# EAGLE design Arduino_fuer_LEDs_DCC_5 (EAGLE 9.5.2)

## Sheet 1 of 2
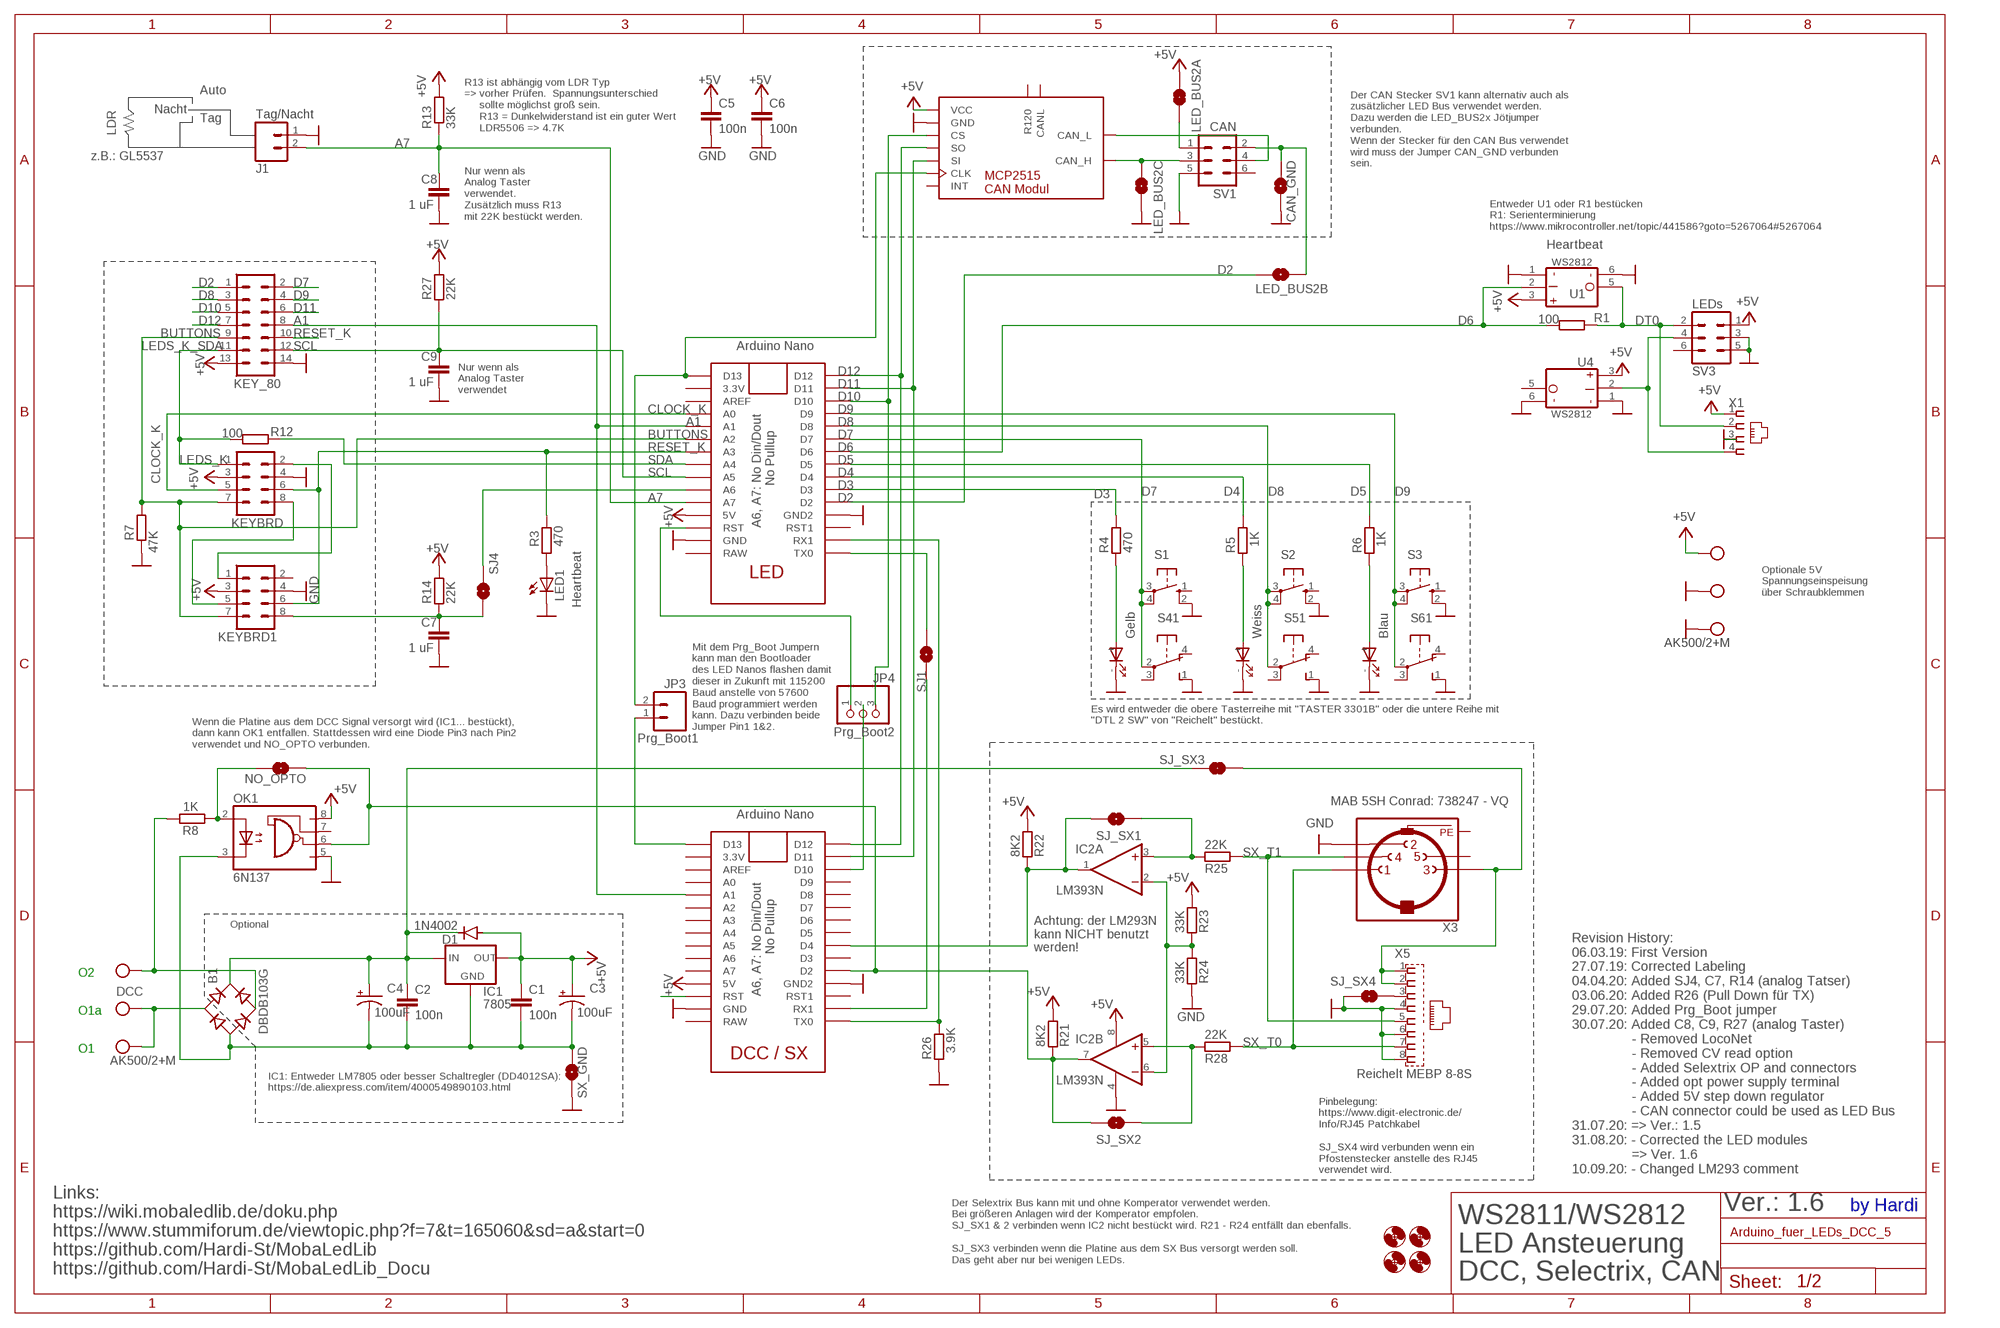
[diagram p0: schematic, sheet 1]

### Parts
B1  DBDB103G  DBDB10G  [DB]
C1  100n  C-EU025-025X050  [C025-025X050]
C2  100n  C-EU025-025X050  [C025-025X050]
C3  100uF  SPARKFUN-CAPACITORS_100UF-25V-20%(PTH)  [SPARKFUN-CAPACITORS_CPOL-RADIAL-100UF-25V]
C4  100uF  SPARKFUN-CAPACITORS_100UF-25V-20%(PTH)  [SPARKFUN-CAPACITORS_CPOL-RADIAL-100UF-25V]
C5  100n  C-EU025-025X050  [C025-025X050]
C6  100n  C-EU025-025X050  [C025-025X050]
C7  1 uF  C-EU025-025X050  [C025-025X050]
C8  1 uF  C-EU025-025X050  [C025-025X050]
C9  1 uF  C-EU025-025X050  [C025-025X050]
CAN2  MCP2515_CAN_MODUL  [MCP2515_CAN_MODUL]
CAN_GND  SOLDERJUMPERNO  [SJ_2S-NO]
D1  1N4002  1N4004  [DO41-10]
H1  MOUNT-HOLE3.0  [3,0]
H2  MOUNT-HOLE3.0  [3,0]
H3  MOUNT-HOLE3.0  [3,0]
H4  MOUNT-HOLE3.0  [3,0]
IC1  7805  78XXS  [78XXS]
IC2  LM393N  [DIL08]
J1  Tag/Nacht  M02PTH  [1X02]
JP3  Prg_Boot1  M02PTH  [1X02]
JP4  Prg_Boot2  PINHD-1X3CB  [1X03-CLEANBIG]
KEY_80  ML14  [ML14]
KEYBRD  CON-HARTING-ML_ML08  [CON-HARTING-ML_ML08]
KEYBRD1  CON-HARTING-ML_ML08  [CON-HARTING-ML_ML08]
LED1  Heartbeat  LED3MM  [LED3MM]
LED_BUS2A  SOLDERJUMPERNO  [SJ_2S-NO]
LED_BUS2B  SOLDERJUMPERNO  [SJ_2S-NO]
LED_BUS2C  SOLDERJUMPERNO  [SJ_2S-NO]
NO_OPTO  SOLDERJUMPERNO  [SJ_2S-NO]
OK1  6N137  [DIL08]
R1  100  R0204/7  [0204/7]
R3  470  R0204/7  [0204/7]
R4  470  R0204/7  [0204/7]
R5  1K  R0204/7  [0204/7]
R6  1K  R0204/7  [0204/7]
R7  47K  R0204/7  [0204/7]
R8  1K  R0204/7  [0204/7]
R12  100  R0204/7  [0204/7]
R13  33K  R0204/7  [0204/7]
R14  22K  R0204/7  [0204/7]
R21  8K2  R-EU_0207/2V  [0207/2V]
R22  8K2  R-EU_0207/2V  [0207/2V]
R23  33K  R-EU_0207/2V  [0207/2V]
R24  33K  R-EU_0207/2V  [0207/2V]
R25  22K  R-EU_0207/2V  [0207/2V]
R26  3.9K  R0204/7  [0204/7]
R27  22K  R0204/7  [0204/7]
R28  22K  R-EU_0207/2V  [0207/2V]
S1  10-XX  [B3F-10XX]
S2  10-XX  [B3F-10XX]
S3  10-XX  [B3F-10XX]
S4  Gelb  SRKL  [SRKL]
S5  Weiss  SRKL  [SRKL]
S6  Blau  SRKL  [SRKL]
SJ1  SOLDERJUMPERNO  [SJ_2S-NO]
SJ4  SOLDERJUMPERNO  [SJ_2S-NO]
SJ_SX1  SOLDERJUMPERNO  [SJ_2S-NO]
SJ_SX2  SOLDERJUMPERNO  [SJ_2S-NO]
SJ_SX3  SOLDERJUMPERNO  [SJ_2S-NO]
SJ_SX4  SOLDERJUMPERNO  [SJ_2S-NO]
SV1  CAN  ML6  [ML6]
SV3  LEDs  ML6  [ML6]
SX_GND  SOLDERJUMPERNO  [SJ_2S-NO]
U1  WS2812_MODUL  [WS2812_LED_MODUL]
U2  LED NANO  NANO  [NANO]
U3  DCC NANO  NANO  [NANO]
U4  WS2812_MODUL  [WS2812_LED_MODUL]
X1  RJ10  [RJ10]
X2  AK500/2+M  [AK500/2+M]
X3  MAB 5SH Conrad: 738247 - VQ  MAB5SH  [MAB5SH]
X4  AK500/2+M  [AK500/2+M]
X5  Reichelt MEBP 8-8S  RJ45_MEBP8-8S  [RJ45_MEBP8-8S]

### Nets
+5V: C1.1 C3.1(+) C5.1 C6.1 CAN2.1(VCC) D1.A IC1.OUT IC2.8(P:V+) KEY_80.13 KEYBRD1.3 KEYBRD.3 LED_BUS2A.1 OK1.8(VCC) R13.2 R14.2 R21.2 R22.2 R23.2 R27.2 SV3.1 U1.3(VDD) U2.5V U3.5V U4.3(VDD) X1.1 X4.2 ; also sheet 2
A1: KEY_80.8 U2.A1 U3.A1
A7: C8.1 J1.2 R13.1 U2.A7
BUTTONS: KEY_80.9 KEYBRD1.7 KEYBRD.7 R7.2 U2.A2
CAN_H: CAN2.9(CAN_H) LED_BUS2C.1 SV1.3
CAN_L: CAN2.8(CAN_L) SV1.4
CLOCK_K: KEYBRD.5 U2.A0
D2: KEY_80.1 LED_BUS2B.1 U2.D2
D3: R4.2 U2.D3
D4: R5.2 U2.D4
D5: R6.2 U2.D5
D6: R1.2 U1.2(DIN) U2.D6
D7: KEY_80.2 S1.3(P) S1.4(P1) S4.2(1:P) U2.D7
D8: KEY_80.3 S2.3(P) S2.4(P1) S5.2(1:P) U2.D8
D9: KEY_80.4 S3.3(P) S3.4(P1) S6.2(1:P) U2.D9
D10: CAN2.3(CS) JP4.3 KEY_80.5 U2.D10
D11: CAN2.5(SI) KEY_80.6 U2.D11 U3.D11
D12: CAN2.4(SO) KEY_80.7 U2.D12 U3.D12
DT0: R1.1 SV3.2 U1.5(DO) X1.2 ; also sheet 2
GND: C5.2 C6.2 C7.2 C8.2 C9.2 CAN2.2(GND) CAN_GND.2 IC2.4(P:V-) J1.1 KEY_80.14 KEYBRD1.4 KEYBRD.4 LED1.K(C) LED_BUS2C.2 OK1.5(GND) R7.1 R24.1 R26.1 S1.2(S1) S2.2(S1) S3.2(S1) S4.1(1:S) S4.-(D1:C) S5.1(1:S) S5.-(D1:C) S6.1(1:S) S6.-(D1:C) SJ_SX4.2 SV1.5 SV3.3 SV3.5 SX_GND.2 U1.1(GND) U1.6(GND1) U2.GND U2.GND1(GND2) U3.GND U3.GND1(GND2) U4.1(GND) U4.6(GND1) X1.3 X3.2 X4.1 X4.M X5.4 X5.6 X5.8 ; also sheet 2
LEDS_K_SDA: KEY_80.11 KEYBRD.1 R12.2
N$1: SJ1.2 U2.TX0
N$2: SJ_SX4.1 X5.3
N$3: R26.2 U2.RX1 U3.TX0
N$4: R4.1 S4.+(D1:A)
N$5: CAN2.6(CLK) JP3.2 U2.D13
N$6: R5.1 S5.+(D1:A)
N$7: R6.1 S6.+(D1:A)
N$8: IC2.7(B:OUT) NO_OPTO.1 OK1.6(VO) R21.1 SJ_SX2.2 U3.D2
N$9: U3.RST
N$10: LED_BUS2A.2 SV1.1
N$11: SV3.4 U4.2(DIN) X1.4
N$12: B1.AC2 R8.2 X2.2
N$13: B1.AC1 X2.1 X2.M
N$14: B1.+ C2.1 C4.1(+) D1.C IC1.IN SJ_SX3.2
N$15: JP4.1 U2.RST
N$16: IC2.1(A:OUT) R22.1 SJ_SX1.2 U3.D4
N$17: B1.- C1.2 C2.2 C3.2(-) C4.2(-) IC1.GND OK1.3(C) SX_GND.1
N$18: SJ1.1 U3.RX1
N$19: LED1.A R3.1
N$20: JP3.1 U3.D13
N$21: NO_OPTO.2 OK1.2(A) R8.1
N$23: C7.1 KEYBRD1.8 R14.1 SJ4.2
N$24: KEYBRD1.1 KEYBRD.2
N$25: KEYBRD1.5 KEYBRD.8
N$26: SJ_SX3.1 X3.3 X5.1 X5.2
N$27: SJ4.1 U2.A6
N$28: JP4.2 U3.D10
N$29: CAN_GND.1 LED_BUS2B.2 SV1.2
N$38: IC2.2(A:-IN) IC2.6(B:-IN) R23.1 R24.2
N$39: IC2.3(A:+IN) R25.1 SJ_SX1.1
N$42: IC2.5(B:+IN) R28.1 SJ_SX2.1
RESET_K: KEY_80.10 KEYBRD1.6 KEYBRD.6 R3.2 U2.A3
SCL: C9.1 KEY_80.12 R27.1 U2.A5
SDA: R12.1 U2.A4
SX_T0: R28.2 X3.1 X5.7
SX_T1: R25.2 X3.4 X5.5
Unconnected: CAN2.7(INT) CAN2.10(R120) CAN2.11(CANL) KEYBRD1.2 OK1.7(VE) S1.1(S) S2.1(S) S3.1(S) S4.3(1:P) S4.4(1:O) S5.3(1:P) S5.4(1:O) S6.3(1:P) S6.4(1:O) SV1.6 SV3.6 U2.3.3V U2.AREF U2.RAW U2.RST1 U3.3.3V U3.A0 U3.A2 U3.A3 U3.A4 U3.A5 U3.A6 U3.A7 U3.AREF U3.D3 U3.D5 U3.D6 U3.D7 U3.D8 U3.D9 U3.RAW U3.RST1 U4.5(DO) X3.5

### Notes on the sheet
- R13 ist abhängig vom LDR Typ
  => vorher Prüfen.  Spannungsunterschied
       sollte möglichst groß sein.
       R13 = Dunkelwiderstand ist ein guter Wert
       LDR5506 => 4.7K
- Der CAN Stecker SV1 kann alternativ auch als
  zusätzlicher LED Bus verwendet werden.
  Dazu werden die LED_BUS2x Jötjumper
  verbunden.
  Wenn der Stecker für den CAN Bus verwendet
  wird muss der Jumper CAN_GND verbunden
  sein.
- Auto
- Nacht
- Tag
- LDR
- z.B.: GL5537
- Nur wenn als
  Analog Taster
  verwendet.
  Zusätzlich muss R13 
  mit 22K bestückt werden.
- Entweder U1 oder R1 bestücken 
  R1: Serienterminierung
  https://www.mikrocontroller.net/topic/441586?goto=5267064#5267064
- Heartbeat
- Nur wenn als
  Analog Taster
  verwendet
- LEDS_K
- A6, A7: No Din/Dout 
              No Pullup
- LED
- Optionale 5V
  Spannungseinspeisung
  über Schraubklemmen
- Es wird entweder die obere Tasterreihe mit "TASTER 3301B" oder die untere Reihe mit 
  "DTL 2 SW" von "Reichelt" bestückt.
- Wenn die Platine aus dem DCC Signal versorgt wird (IC1... bestückt), 
  dann kann OK1 entfallen. Stattdessen wird eine Diode Pin3 nach Pin2
  verwendet und NO_OPTO verbunden.
- Mit dem Prg_Boot Jumpern
  kann man den Bootloader
  des LED Nanos flashen damit
  dieser in Zukunft mit 115200
  Baud anstelle von 57600
  Baud programmiert werden 
  kann. Dazu verbinden beide
  Jumper Pin1 1&2.
- Optional
- Achtung: der LM293N
  kann NICHT benutzt
  werden!
- O2
- DCC
- A6, A7: No Din/Dout 
              No Pullup
- O1a
- DCC / SX
- O1
- IC1: Entweder LM7805 oder besser Schaltregler (DD4012SA):
  https://de.aliexpress.com/item/4000549890103.html
- Pinbelegung:
  https://www.digit-electronic.de/
  Info/RJ45 Patchkabel
  
  SJ_SX4 wird verbunden wenn ein 
  Pfostenstecker anstelle des RJ45 
  verwendet wird.
- Revision History:
  06.03.19: First Version
  27.07.19: Corrected Labeling
  04.04.20: Added SJ4, C7, R14 (analog Tatser)
  03.06.20: Added R26 (Pull Down für TX)
  29.07.20: Added Prg_Boot jumper
  30.07.20: Added C8, C9, R27 (analog Taster)
                 - Removed LocoNet
                 - Removed CV read option
                 - Added Selextrix OP and connectors
                 - Added opt power supply terminal 
                 - Added 5V step down regulator
                 - CAN connector could be used as LED Bus
  31.07.20: => Ver.: 1.5
  31.08.20: - Corrected the LED modules
                 => Ver. 1.6
  10.09.20: - Changed LM293 comment
- Der Selextrix Bus kann mit und ohne Komperator verwendet werden.
  Bei größeren Anlagen wird der Komperator empfolen. 
  SJ_SX1 & 2 verbinden wenn IC2 nicht bestückt wird. R21 - R24 entfällt dan ebenfalls.
  
  SJ_SX3 verbinden wenn die Platine aus dem SX Bus versorgt werden soll.
  Das geht aber nur bei wenigen LEDs.
- Ver.: 1.6 | by Hardi
- Links:
  https://wiki.mobaledlib.de/doku.php
  https://www.stummiforum.de/viewtopic.php?f=7&t=165060&sd=a&start=0
  https://github.com/Hardi-St/MobaLedLib
  https://github.com/Hardi-St/MobaLedLib_Docu
- WS2811/WS2812
  LED Ansteuerung
  DCC, Selectrix, CAN

## Sheet 2 of 2
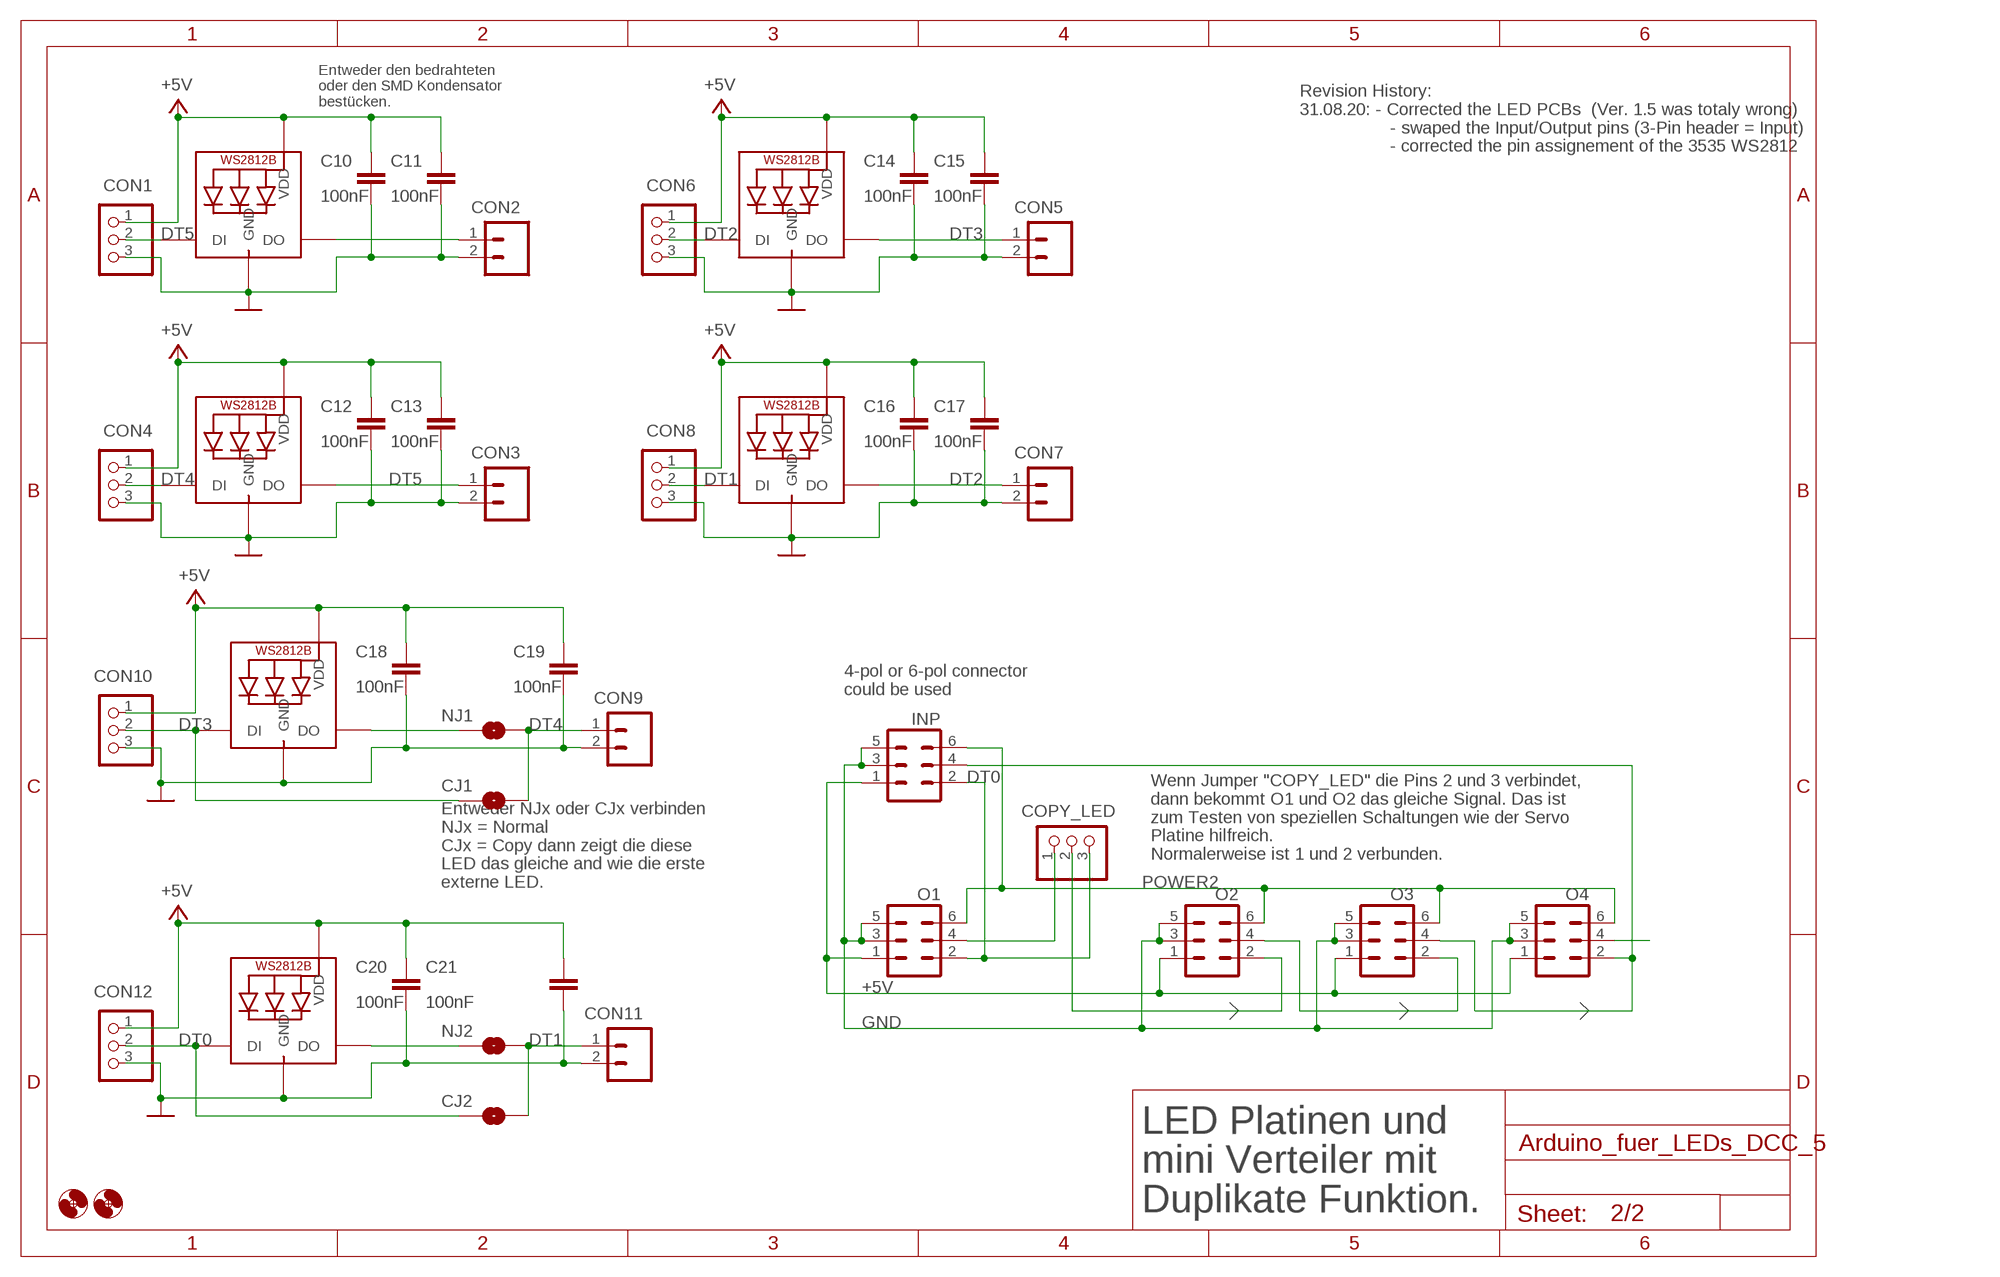
[diagram p1: schematic, sheet 2]

### Parts
C10  100nF  C-EU025-025X050  [C025-025X050]
C11  100nF  C-EUC1206  [C1206]
C12  100nF  C-EU025-025X050  [C025-025X050]
C13  100nF  C-EUC1206  [C1206]
C14  100nF  C-EU025-025X050  [C025-025X050]
C15  100nF  C-EUC1206  [C1206]
C16  100nF  C-EU025-025X050  [C025-025X050]
C17  100nF  C-EUC1206  [C1206]
C18  100nF  C-EU025-025X050  [C025-025X050]
C19  100nF  C-EUC1206  [C1206]
C20  100nF  C-EU025-025X050  [C025-025X050]
C21  100nF  C-EUC1206  [C1206]
CJ1  SOLDERJUMPERNO  [SJ_2S-NO]
CJ2  SOLDERJUMPERNO  [SJ_2S-NO]
CON1  PINHD-1X3CB  [1X03-CLEANBIG]
CON2  M02PTH  [1X02]
CON3  M02PTH  [1X02]
CON4  PINHD-1X3CB  [1X03-CLEANBIG]
CON5  M02PTH  [1X02]
CON6  PINHD-1X3CB  [1X03-CLEANBIG]
CON7  M02PTH  [1X02]
CON8  PINHD-1X3CB  [1X03-CLEANBIG]
CON9  M02PTH  [1X02]
CON10  PINHD-1X3CB  [1X03-CLEANBIG]
CON11  M02PTH  [1X02]
CON12  PINHD-1X3CB  [1X03-CLEANBIG]
COPY_LED  PINHD-1X3CB  [1X03-CLEANBIG]
H5  MOUNT-HOLE3.0  [3,0]
H6  MOUNT-HOLE3.0  [3,0]
INP  ML6  [ML6]
LED2  WS2812B5050  [WS2812B]
LED3  WS2812B5050  [WS2812B]
LED4  WS2812B3535  [LED3535]
LED5  WS2812B3535  [LED3535]
LED6  WS2812B5050  [WS2812B]
LED7  WS2812B3535  [LED3535]
NJ1  SOLDERJUMPERNO  [SJ_2S-NO]
NJ2  SOLDERJUMPERNO  [SJ_2S-NO]
O1  ML6  [ML6]
O2  ML6  [ML6]
O3  ML6  [ML6]
O4  ML6  [ML6]

### Nets
+5V: C10.1 C11.1 C12.1 C13.1 C14.1 C15.1 C16.1 C17.1 C18.1 C19.1 C20.1 C21.1 CON1.1 CON4.1 CON6.1 CON8.1 CON10.1 CON12.1 INP.1 LED2.1-5V(VDD) LED3.1-5V(VDD) LED4.1_5V(VDD) LED5.1_5V(VDD) LED6.1-5V(VDD) LED7.1_5V(VDD) O1.1 O2.1 O3.1 O4.1 ; also sheet 1
DT0: CJ2.1 CON12.2 COPY_LED.3 INP.2 LED7.4_DIN(DI) O1.2 ; also sheet 1
DT1: CJ2.2 CON8.2 CON11.1 LED5.4_DIN(DI) NJ2.2
DT2: CON6.2 CON7.1 LED4.4_DIN(DI) LED5.2_DOUT(DO)
DT3: CJ1.1 CON5.1 CON10.2 LED4.2_DOUT(DO) LED6.4-DIN(DI)
DT4: CJ1.2 CON4.2 CON9.1 LED3.4-DIN(DI) NJ1.2
DT5: CON1.2 CON3.1 LED2.4-DIN(DI) LED3.2-DOUT(DO)
GND: C10.2 C11.2 C12.2 C13.2 C14.2 C15.2 C16.2 C17.2 C18.2 C19.2 C20.2 C21.2 CON1.3 CON2.2 CON3.2 CON4.3 CON5.2 CON6.3 CON7.2 CON8.3 CON9.2 CON10.3 CON11.2 CON12.3 INP.3 INP.5 LED2.3-GND(GND) LED3.3-GND(GND) LED4.3_GND(GND) LED5.3_GND(GND) LED6.3-GND(GND) LED7.3_GND(GND) O1.3 O1.5 O2.3 O2.5 O3.3 O3.5 O4.3 O4.5 ; also sheet 1
N$30: CON2.1 LED2.2-DOUT(DO)
N$49: LED6.2-DOUT(DO) NJ1.1
N$52: INP.4 O3.4 O4.2
N$53: O4.4
N$55: COPY_LED.2 O2.2
N$56: LED7.2_DOUT(DO) NJ2.1
N$58: O2.4 O3.2
N$60: COPY_LED.1 O1.4
POWER2: INP.6 O1.6 O2.6 O3.6 O4.6

### Notes on the sheet
- Entweder den bedrahteten 
  oder den SMD Kondensator 
  bestücken.
- Revision History:
  31.08.20: - Corrected the LED PCBs  (Ver. 1.5 was totaly wrong)
                    - swaped the Input/Output pins (3-Pin header = Input)
                    - corrected the pin assignement of the 3535 WS2812
- 4-pol or 6-pol connector
  could be used
- Wenn Jumper "COPY_LED" die Pins 2 und 3 verbindet,
  dann bekommt O1 und O2 das gleiche Signal. Das ist
  zum Testen von speziellen Schaltungen wie der Servo 
  Platine hilfreich.
  Normalerweise ist 1 und 2 verbunden.
- Entweder NJx oder CJx verbinden
  NJx = Normal
  CJx = Copy dann zeigt die diese
  LED das gleiche and wie die erste
  externe LED.
- LED Platinen und
  mini Verteiler mit 
  Duplikate Funktion.

## Power pins joined to a net without a drawn wire
PE: X3.PE X3.PE@(PE)

## Library data of the parts
B1 = Arduino_fuer_LEDs_DCC_2:DB?*G: Single Phase 1.0 AMP Glass Passivated Bridge Rectifier Taiwan Semiconductor Co.,Ltd. - TSC Source: http://www.taiwansemi.com/TSCbig5/ezcatfiles/cust/img/img/db101g.pdf http://www.ts.com.tw/db/pictures/modules/PDT/PDT060207001/DBLS201G.pdf
C1 C2 C5-C21 = rcl:C-EU: CAPACITOR, European symbol
C3 C4 = Sound_MP3-TF-16P_and_WS2811:SPARKFUN-CAPACITORS_100UF-25V-20%(PTH): CAP-08439; PROD_ID: CAP-08439
CAN2 = Arduino_fuer_LEDs_DCC_2_All:MCP2515_CAN_MODUL: MCP2515 CAN Modul
CAN_GND CJ1 CJ2 LED_BUS2A LED_BUS2B LED_BUS2C NJ1 NJ2 NO_OPTO SJ1 SJ4 SJ_SX1-SJ_SX4 SX_GND = SparkFun-Retired:SOLDERJUMPER: Solder Jumper Standard SMD solder jumper. Used to automate production. Two varients : Normally Open and Normally Closed are the same, but have different paste layers. NC will have a large amount of paste and should jumper during reflow.
CON1 CON4 CON6 CON8 CON10 CON12 COPY_LED JP4 = adafruit:PINHD-1X3: PIN HEADER
CON2 CON3 CON5 CON7 CON9 CON11 J1 JP3 = SparkFun-Connectors:M02: Standard 2-pin 0.1" header. Use with - straight break away headers ( PRT-00116) - right angle break away headers (PRT-00553) - swiss pins (PRT-00743) - machine pins (PRT-00117) - female headers (PRT-00115) Molex polarized connector foot print use with: PRT-08233 with associated crimp pins and housings. 2.54_SCREWTERM for use with PRT-10571. 3.5mm Screw Terminal footprints for PRT-08084 5mm Screw Terminal footprints for use with PRT-08432
D1 = diode:1N4004: DIODE general purpose rectifier, 1 A
H1-H6 = holes:MOUNT-HOLE: MOUNTING HOLE with drill center marker
IC1 = v-reg:78XXS: VOLTAGE REGULATOR
IC2 = linear:LM393: COMPARATOR
INP O1-O4 = con-harting-ml:ML6: HARTING; OC_FARNELL: unknown; OC_NEWARK: unknown
KEY_80 = Arduino_fuer_LEDs_DCC_2:ML14: HARTING; OC_FARNELL: unknown; OC_NEWARK: unknown
KEYBRD KEYBRD1 = PushButtonAction_4017_2:CON-HARTING-ML_ML08: Modified by Hardi; OC_FARNELL: unknown; OC_NEWARK: unknown
LED1 = Arduino_fuer_LEDs_DCC_2:LED: LED OSRAM: - CHIPLED LG R971, LG N971, LY N971, LG Q971, LY Q971, LO R971, LY R971 LH N974, LH R974 LS Q976, LO Q976, LY Q976 LO Q996 - Hyper CHIPLED LW Q18S LB Q993, LB Q99A, LB R99A - SideLED LS A670, LO A670, LY A670, LG A670, LP A670 LB A673, LV A673, LT A673, LW A673 LH A674 LY A675 LS A676, LA A676, LO A676, LY A676, LW A676 LS A679, LY A679, LG A679 - Hyper Micro SIDELED® LS Y876, LA Y876, LO Y876, LY Y876 LT Y87S - SmartLED LW L88C, LW L88S LB L89C, LB L89S, LG L890 LS L89K, LO L89K, LY L89K LS L896, LA L896, LO L896, LY L896 - TOPLED LS T670, LO T670, LY T670, LG T670, LP T670 LSG T670, LSP T670, LSY T670, LOP T670, LYG T670 LG T671, LOG T671, LSG T671 LB T673, LV T673, LT T673, LW T673 LH T674 LS T676, LA T676, LO T676, LY T676, LB T676, LH T676, LSB T676, LW T676 LB T67C, LV T67C, LT T67C, LS T67K, LO T67K, LY T67K, LW E67C LS E67B, LA E67B, LO E67B, LY E67B, LB E67C, LV E67C, LT E67C LW T67C LS T679, LY T679, LG T679 LS T770, LO T770, LY T770, LG T770, LP T770 LB T773, LV T773, LT T773, LW T773 LH T774 LS E675, LA E675, LY E675, LS T675 LS T776, LA T776, LO T776, LY T776, LB T776 LHGB T686 LT T68C, LB T68C - Hyper Mini TOPLED® LB M676 - Mini TOPLED Santana® LG M470 LS M47K, LO M47K, LY M47K Source: http://www.osram.convergy.de LUXEON: - LUMILED® LXK2-PW12-R00, LXK2-PW12-S00, LXK2-PW14-U00, LXK2-PW14-V00 LXK2-PM12-R00, LXK2-PM12-S00, LXK2-PM14-U00 LXK2-PE12-Q00, LXK2-PE12-R00, LXK2-PE12-S00, LXK2-PE14-T00, LXK2-PE14-U00 LXK2-PB12-K00, LXK2-PB12-L00, LXK2-PB12-M00, LXK2-PB14-N00, LXK2-PB14-P00, LXK2-PB14-Q00 LXK2-PR12-L00, LXK2-PR12-M00, LXK2-PR14-Q00, LXK2-PR14-R00 LXK2-PD12-Q00, LXK2-PD12-R00, LXK2-PD12-S00 LXK2-PH12-R00, LXK2-PH12-S00 LXK2-PL12-P00, LXK2-PL12-Q00, LXK2-PL12-R00 Source: www.luxeon.com KINGBRIGHT: KA-3528ASYC Source: www.kingbright.com
LED2-LED7 = adafruit:WS2812B
OK1 = Arduino_fuer_LEDs_DCC_2:6N137: MOTOROLA OPTO COUPLER; MPN: 6N137; OC_FARNELL: 1328376; OC_NEWARK: 52M1895
R1 R3-R8 R12-R14 R26 R27 = Arduino_fuer_LEDs_DCC_2:R: RESISTOR, European symbol; SPICEMODEL: NONE; SPICEPREFIX: R
R21-R25 R28 = rcl:R-EU_: RESISTOR, European symbol
S1-S3 = switch-omron:10-XX: OMRON SWITCH; MPN: B3F-1000; OC_FARNELL: 176432; OC_NEWARK: 36M3542
S4-S6 = switch-misc:SRKL: SWITCH
SV1 SV3 = Arduino_fuer_LEDs_DCC_2:ML6: HARTING; OC_FARNELL: unknown; OC_NEWARK: unknown
U1 U4 = Arduino_fuer_LEDs_DCC_2_All:WS2812_MODUL: WS2812 Modul mit Winkelsteckern (by Hardi)
U2 U3 = Arduino_fuer_LEDs_DCC_2:NANO: Arduino Nano
X1 = RJ10:RJ10: RJ10 Connector "C:\Dat\Märklin\Schaltpläne\Allgemein\RJ10_Stecker_Layout.docx" https://de.aliexpress.com/item/100-pcs-lot-RJ11-Grau-4P4-Telefon-Buchse-4P4C-Telefon-Halter-RJ10-Telefon-Halter-PCB-Empf/32951511491.html?spm=a2g0x.search0604.3.106.53184c516NAPTE&transAbTest=ae803_4&ws_ab_test=searchweb0_0%2Csearchweb201602_3_10065_10068_10547_319_317_10548_10696_10084_453_10083_454_10618_10304_10307_10820_10821_537_10302_536_10902_10843_10059_10884_10887_321_322_10103%2Csearchweb201603_57%2CppcSwitch_0&algo_pvid=cf281ae9-d22a-4418-b1b2-d9dd3eca3a16&algo_expid=cf281ae9-d22a-4418-b1b2-d9dd3eca3a16-15; OC_FARNELL: unknown; OC_NEWARK: unknown
X2 X4 = Arduino_fuer_LEDs_DCC_2:AK500/2+M
X3 = con-hirschmann:MAB5SH: Female CONNECTOR 5 pins 90 deg. with shield, horizontal (DIN 41524); OC_FARNELL: 809883; OC_NEWARK: unknown
X5 = RJ45_Reichelt:RJ45_MEBP8-8S: AMP connector

## Board
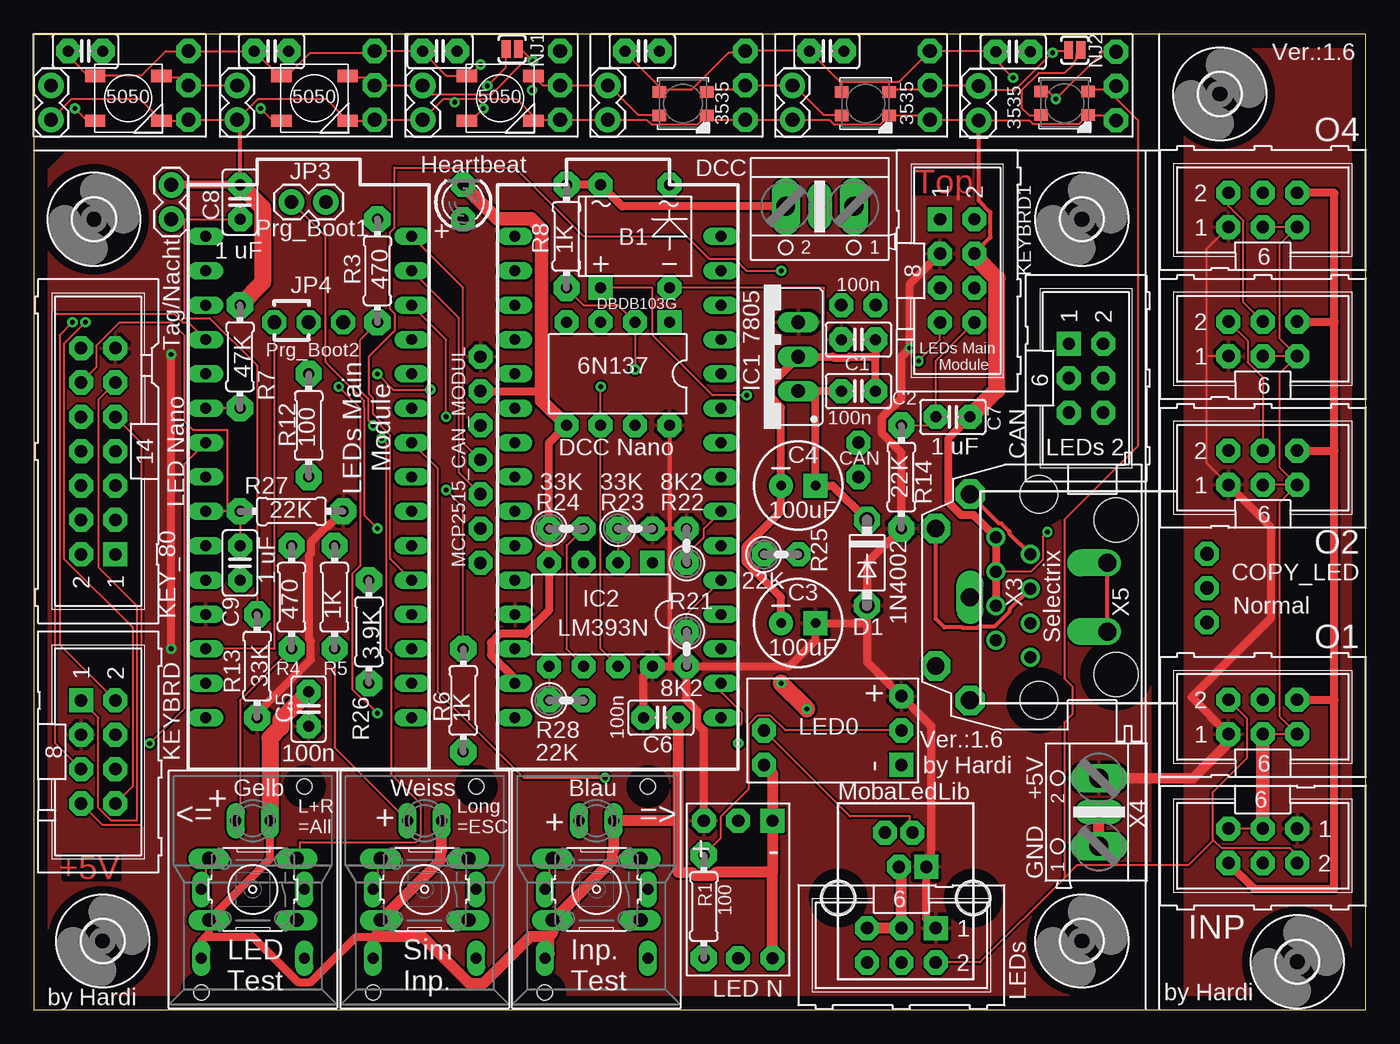
[diagram p2: board, top side]
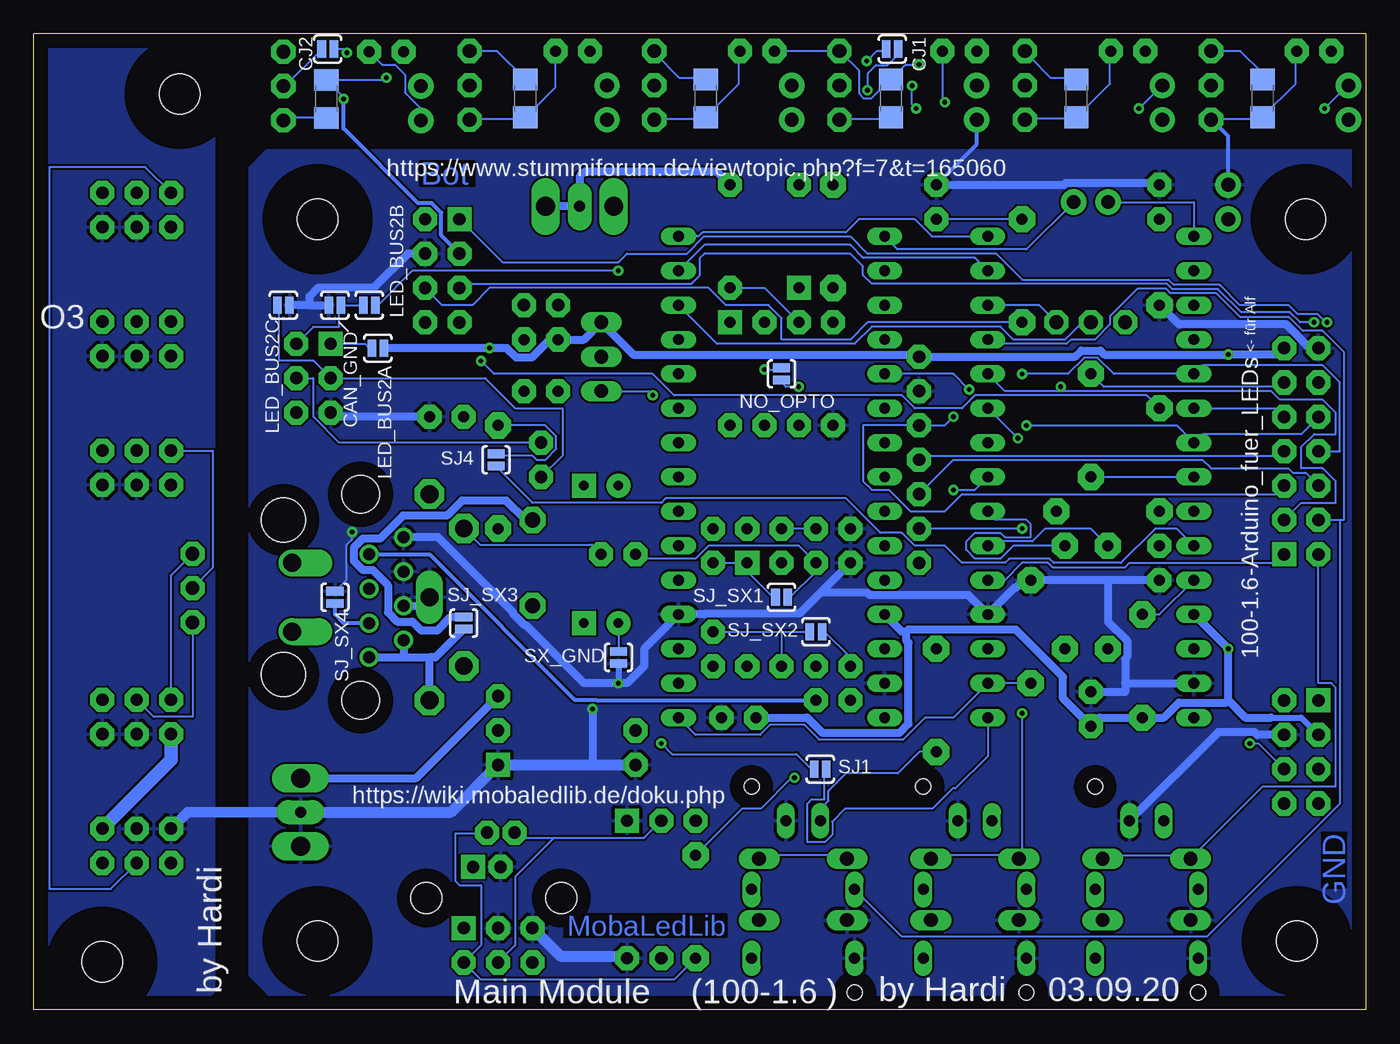
[diagram p3: board, bottom side, seen from below]

Size 98.46 x 72.12 mm. Coordinates in mm from the lower left corner, seen from the top.
Outline: 13.76,72.12 26.46,72.12
Outline: 27.48,72.12 40.18,72.12
Outline: 0,72.12 0,0 98.46,0 98.46,72.12 0,72.12
Copper layers (1*16): Top 0.035mm / dielectric 1.5mm / Bottom 0.035mm
Design rules "default": minimum track width 6mil, minimum drill 0.35mm, track to track 6mil, track to pad 6mil, pad to pad 6mil, via to via 6mil, smd to smd 6mil, copper to edge 40mil, drill to drill 6mil, minimum pad ring 10mil, minimum via ring 8mil, stop-mask expansion 4mil, vias tented up to drill 0mil, thermal gap 10mil

### Footprints (pad centres in the part's own frame; a part is rotated, then mirrored left to right if it is on the bottom)
DB = drill 0.813 pad 1.778 square: + -2.54,-3.81 | drill 0.813 pad 1.778 octagon: - 2.54,-3.81; AC1 2.54,3.81; AC2 -2.54,3.81
C025-025X050 = drill 0.813 pad 1.778 octagon: 1 -1.27,0; 2 1.27,0
SPARKFUN-CAPACITORS_CPOL-RADIAL-100UF-25V = drill 0.7 pad 1.778 square: 1 1.27,0 | drill 0.7 pad 1.778: 2 -1.27,0
C1206 = smd 1.6 x 1.8: 1 -1.4,0; 2 1.4,0
MCP2515_CAN_MODUL = drill 0.914 pad 1.778 octagon: 1 0,0; 2 0,-2.54; 3 0,-5.08; 4 0,-7.62; 5 0,-10.16; 6 0,-12.7; 7 0,-15.24; 8 27.94,-6.35; 9 27.94,-8.89; 10 26.67,3.81; 11 29.21,3.81
SJ_2S-NO = smd 0.635 x 1.27: 1 -0.45,0; 2 0.45,0
1X03-CLEANBIG = drill 1.016 pad 1.778 octagon: 1 -2.54,0; 2 0,0; 3 2.54,0
1X02 = drill 1.016 pad 1.88: 1 0,0; 2 2.54,0
DO41-10 = drill 1.118 pad 1.93 octagon: A 3.175,0; C -3.175,0
3,0 = hole 3: 0,0
78XXS = drill 1.016 long: GND 0,-2.54; IN -2.54,-2.54; OUT 2.54,-2.54
DIL08 = drill 0.813 pad 1.778 square: 1 -3.81,-3.81 | drill 0.813 pad 1.778 octagon: 2 -1.27,-3.81; 3 1.27,-3.81; 4 3.81,-3.81; 5 3.81,3.81; 6 1.27,3.81; 7 -1.27,3.81; 8 -3.81,3.81
ML6 = drill 0.914 pad 1.778 octagon: 1 -2.54,-1.27; 2 -2.54,1.27; 3 0,-1.27; 4 0,1.27; 5 2.54,-1.27; 6 2.54,1.27
ML14 = drill 0.914 pad 1.778 square: 1 -7.62,-1.27 | drill 0.914 pad 1.778 octagon: 2 -7.62,1.27; 3 -5.08,-1.27; 4 -5.08,1.27; 5 -2.54,-1.27; 6 -2.54,1.27; 7 0,-1.27; 8 0,1.27; 9 2.54,-1.27; 10 2.54,1.27; 11 5.08,-1.27; 12 5.08,1.27; 13 7.62,-1.27; 14 7.62,1.27
CON-HARTING-ML_ML08 = drill 0.914 pad 1.778 square: 1 -5.08,-1.27 | drill 0.914 pad 1.778 octagon: 2 -5.08,1.27; 3 -2.54,-1.27; 4 -2.54,1.27; 5 0,-1.27; 6 0,1.27; 7 2.54,-1.27; 8 2.54,1.27
LED3MM = drill 0.813 pad 1.778 octagon: A -1.27,0; K 1.27,0
WS2812B = smd 1.5 x 0.9: 1-5V 2.45,-1.65; 2-DOUT 2.45,1.65; 3-GND -2.45,1.65; 4-DIN -2.45,-1.65
LED3535 = smd 1 x 0.85: 1_5V 1.75,-0.875; 2_DOUT 1.75,0.875; 3_GND -1.75,0.875; 4_DIN -1.75,-0.875
0204/7 = drill 0.813 pad 1.93 octagon: 1 -3.81,0; 2 3.81,0
0207/2V = drill 0.813 pad 1.778 octagon: 1 -1.27,0; 2 1.27,0
B3F-10XX = drill 1.016 long: 1 -3.251,2.261; 2 3.251,2.261; 3 -3.251,-2.261; 4 3.251,-2.261
SRKL = drill 0.813 long: 1 -3.81,-5.08; 2 -3.81,0; 3 3.81,0; 4 3.81,-5.08; + -1.27,5.08; - 1.27,5.08 | hole 1.118: 3.81,7.62; -3.81,-7.62
ML6' = drill 0.914 pad 1.778 square: 1 -2.54,-1.27 | drill 0.914 pad 1.778 octagon: 2 -2.54,1.27; 3 0,-1.27; 4 0,1.27; 5 2.54,-1.27; 6 2.54,1.27
WS2812_LED_MODUL = drill 0.914 pad 1.778 square: 1 -5.08,-5.08 | drill 0.914 pad 1.778 octagon: 2 -2.54,-5.08; 3 0,-5.08; 5 -2.54,5.08; 6 -5.08,5.08
NANO = drill 0.8 long: 3.3V -10.16,24.13; 5V -10.16,-1.27; A0 -10.16,19.05; A1 -10.16,16.51; A2 -10.16,13.97; A3 -10.16,11.43; A4 -10.16,8.89; A5 -10.16,6.35; A6 -10.16,3.81; A7 -10.16,1.27; AREF -10.16,21.59; D2 5.08,1.27; D3 5.08,3.81; D4 5.08,6.35; D5 5.08,8.89; D6 5.08,11.43; D7 5.08,13.97; D8 5.08,16.51; D9 5.08,19.05; D10 5.08,21.59; D11 5.08,24.13; D12 5.08,26.67; D13 -10.16,26.67; GND -10.16,-6.35; GND1 5.08,-1.27; RAW -10.16,-8.89; RST -10.16,-3.81; RST1 5.08,-3.81; RX1 5.08,-6.35; TX0 5.08,-8.89
RJ10 = drill 0.9 pad 1.778 square: 1 -1.524,-2.3 | drill 0.9 pad 1.778 octagon: 2 -0.508,-4.84; 3 0.508,-2.3; 4 1.524,-4.84 | hole 2.3: 5,0; -5,0
AK500/2+M = drill 1.397 long: 1 -2.515,0; 2 2.515,0 | drill 0.813 pad 1.778 long: M 0,0
MAB5SH = drill 1.321 pad 2.184 octagon: 1 7.62,5.08; 3 -7.62,5.08; 4 5.08,7.62; 5 -5.08,7.62 | drill 1.321 long: 2 0,5.08 | drill 1.321 offset: PE -2.54,-5.08; PE@ 2.54,-5.08 | hole 2.794: 7.62,0; -7.62,0
RJ45_MEBP8-8S = drill 0.889: 1 -4.445,6.35; 2 -3.175,8.89; 3 -1.905,6.35; 4 -0.635,8.89; 5 0.635,6.35; 6 1.905,8.89; 7 3.175,6.35; 8 4.445,8.89 | hole 3.251: -5.715,0; 5.715,0

### Placement (x,y rotation side)
B1  44.45,57.15 0 top
C1  60.96,49.53 0 top
C2  60.96,45.72 0 top
C3  56.52,28.57 0 top
C4  56.52,38.73 0 top
C5  20.32,22.23 90 top
C6  46.35,21.59 0 top
C7  67.94,43.81 0 top
C8  15.24,59.69 90 top
C9  15.24,33.02 270 top
C10  3.81,70.85 0 top
C11  7.62,67.36 270 bottom
C12  17.57,70.85 0 top
C13  21.38,67.36 270 bottom
C14  44.97,70.85 0 top
C15  48.78,67.36 270 bottom
C16  58.63,70.85 0 top
C17  62.12,67.36 270 bottom
C18  30.02,70.85 0 top
C19  35.1,67.36 270 bottom
C20  72.39,70.8 0 top
C21  76.83,67.31 270 bottom
CAN2  33.02,48.26 0 top
CAN_GND  76.2,52.07 180 bottom
CJ1  35,71 180 bottom
CJ2  76.73,71 0 bottom
CON1  11.43,68.31 270 top
CON2  1.27,68.31 270 top
CON3  15.03,68.31 270 top
CON4  25.19,68.31 270 top
CON5  42.43,68.31 270 top
CON6  52.59,68.31 270 top
CON7  56.09,68.31 270 top
CON8  66.25,68.31 270 top
CON9  28.75,68.31 270 top
CON10  38.91,68.31 270 top
CON11  69.85,68.26 270 top
CON12  80.01,68.26 270 top
COPY_LED  86.72,31.16 90 top
D1  61.59,33.02 270 top
H1  5.08,5.08 0 top
H2  4.45,58.42 0 top
H3  77.47,58.42 0 top
H4  77.47,5.08 0 top
H5  93.39,3.54 0 top
H6  87.68,67.67 0 top
IC1  53.98,48.26 90 top
IC2  41.91,29.21 180 top
INP  90.85,12.11 180 top
J1  10.16,60.96 270 top
JP3  21.59,59.69 180 top
JP4  20.32,50.8 0 top
KEY_80  4.76,41.27 90 top
KEYBRD  4.76,17.78 270 top
KEYBRD1  68.26,53.34 270 top
LED1  31.75,59.69 90 top
LED2  6.99,67.36 180 top
LED3  20.75,67.36 180 top
LED4  47.99,66.96 180 top
LED5  61.48,66.96 180 top
LED6  34.47,67.36 180 top
LED7  76.2,66.99 180 top
LED_BUS2A  73.03,48.9 180 bottom
LED_BUS2B  73.66,52.07 180 bottom
LED_BUS2C  80.01,52.07 0 bottom
NJ1  35.37,71 0 top
NJ2  76.95,70.92 180 top
NO_OPTO  43.18,46.99 90 bottom
O1  90.85,21.64 0 top
O2  90.85,40.05 0 top
O3  90.85,49.58 0 top
O4  90.85,59.1 0 top
OK1  43.18,46.99 180 top
R1  49.53,7.62 90 top
R3  25.4,54.61 270 top
R4  19.05,30.48 90 top
R5  22.23,30.48 90 top
R6  31.75,22.86 90 top
R7  15.24,48.26 270 top
R8  39.37,57.15 90 top
R12  20.32,43.18 90 top
R13  16.51,25.4 270 top
R14  64.14,39.37 270 top
R21  48.26,26.67 270 top
R22  48.26,34.29 90 top
R23  44.45,35.56 0 top
R24  39.37,35.56 0 top
R25  55.24,33.66 0 top
R26  24.77,27.94 270 top
R27  19.05,36.83 0 top
R28  39.37,22.86 0 top
S1  16.19,8.89 180 top
S2  28.89,8.89 180 top
S3  41.59,8.89 180 top
S4  16.19,8.89 0 top
S5  28.89,8.89 0 top
S6  41.59,8.89 0 top
SJ1  40.32,17.78 0 bottom
SJ4  64.29,40.64 90 bottom
SJ_SX1  43.18,30.48 180 bottom
SJ_SX2  40.64,27.94 180 bottom
SJ_SX3  66.67,28.57 90 bottom
SJ_SX4  76.2,30.48 90 bottom
SV1  CAN  [ML6']  77.79,46.67 270 top
SV3  LEDs  [ML6']  64.14,4.76 180 top
SX_GND  55.24,26.04 270 bottom
U1  59.05,23.18 90 top
U2  22.86,30.48 0 top
U3  45.72,30.48 0 top
U4  49.53,8.89 180 top
X1  64.45,8.26 180 top
X2  58.1,59.37 180 top
X3  74.3,30.48 90 top
X4  78.74,14.61 90 top
X5  80.01,30.48 90 top

### Tracks (layer width: path | path; a pad name or v marks a point on that pad's centre or on a via)
+5V  (via drill 0.35)
  Top 0.152: C14.1 43.74,70.71 46.18,68.28 46.18,67.97 LED4.1_5V 46.33,67.97 48.62,67.97 51.36,70.71 52.58,70.71 CON6.1 52.73,70.87 57.3,70.87 C16.1 57.45,70.71 59.59,68.58 | 59.59,68.58 59.59,67.97 LED5.1_5V | v33.02,69.85 32.18,69.01 LED6.1-5V 32,69.04 30.48,69.04 28.8,70.71 C18.1 28.65,70.87 25.3,70.87 CON4.1 25.15,70.71 20.42,70.71 18.75,69.04 18.44,69.04 LED3.1-5V 18.15,69.01 C12.1 CON1.1 9.74,70.85 7.92,69.04 4.57,69.04 LED2.1-5V 4.45,68.58 2.54,70.48 C10.1 | 59.59,68.58 63.98,68.58 CON8.1 66.29,70.87 71.02,70.87 C20.1 71.12,70.15 v72.39,68.88 | LED7.1_5V 75.01,67.87 v75.56,67.31 79.06,70.8 CON12.1 | 86.68,48.31 86.68,56.2 O4.1 | 86.68,48.31 86.68,40.42 O2.1 | O3.1 86.68,48.31
  Top 0.305: R23.2 46.99,35.56 | R22.2 46.99,35.56 | OK1.8 46.99,35.56 | 46.99,35.56 46.99,25.4
  Top 0.61: 61.59,28.57 C3.1 57.78,27.3 55.88,25.4 R21.2 | 61.59,28.57 D1.A 61.59,33.02 R14.2 64.14,41.17 62.71,42.59 62.71,43.77 64.14,45.19 64.14,48.26 v64.77,48.9 64.77,53.66 KEYBRD1.3 | 61.59,28.57 61.59,25.72 U1.3 66.36,20.95 66.36,11.11 65.98,10.73 X1.1 65.98,6.73 SV3.1 | R27.2 21.74,35.71 21.64,35.71 20.47,34.55 20.47,33.7 20.32,33.55 20.32,27.41 20.47,27.26 20.47,25.87 16.51,21.91 R13.2 | C6.1 45.09,24.77 IC2.8 46.99,25.4 R21.2 | U4.3 49.53,20.64 49.03,21.13 49.03,22.09 48.26,22.86 R21.2 | v10.16,26.67 v10.16,48.42 | O2.1 91.44,35.66 91.44,28.94 85.59,23.09 O1.1
  Top 0.762: X4.2 85.7,17.12 88.31,19.73 O1.1
  Bottom 0.152: 24.84,70.41 25.15,70.71 CON4.1 24.84,70.41 | 24.84,70.41 23.32,68.89 21.49,68.89 C13.1 | C15.1 48.92,68.89 50.75,68.89 52.58,70.71 CON6.1 | C14.1 CON10.1 37.44,69.38 37.44,67.69 37.08,67.34 36.58,67.34 35.16,68.76 C19.1 34.01,69.85 v33.02,69.85 | C17.1 64.21,70.85 CON8.1 | v75.56,67.31 75.56,67.44 C21.1 72.56,68.71 v72.39,68.88 | C11.1 7.62,69.22 9.26,70.85 CON1.1
  Bottom 0.305: KEYBRD1.3 68.34,57.23 68.34,58.91 69.04,59.61 70.05,59.61 75.56,65.13 v75.56,67.31
  Bottom 0.457: KEYBRD.3 4.76,21.59 6.99,21.59
  Bottom 0.61: LED_BUS2A.1 v64.77,48.9 63.5,48.9 62.79,48.18 61.67,48.18 60.33,49.53 C1.1 57.78,49.53 IC1.OUT 54.13,48.42 33.18,48.42 CAN2.1 21.49,48.26 21.04,48.72 19.61,48.72 19.31,48.42 v10.16,48.42 6.51,48.42 KEY_80.13 | U3.5V 34.29,27.94 33.97,27.94 | 33.97,27.94 33.82,28.09 25.87,28.09 22.38,24.61 22.38,23.02 C5.1 19.68,21.59 R13.2 14.93,21.59 13.81,22.7 10.32,22.7 10.16,22.86 | 33.97,27.94 33.97,27.31 33.8,27.13 33.8,21.13 34.45,20.48 40.16,20.48 41.27,21.59 C6.1 | X4.2 70.19,17.12 U1.3 | U2.5V v10.16,26.67 10.16,22.86 | 10.16,22.86 8.89,21.59 6.99,21.59
  Bottom 1.016: INP.1 88.31,18.46 O1.1
  pour Top: 0,60.96 2.54,63.5 3.81,63.5 82.55,63.5 82.55,5.08 81.28,3.81 77.47,0 0,0
  pour Top: 85.09,71.17 98.11,71.17 98.11,0.05 85.09,0.05
A1  (via drill 0.35)
  Top 0.152: v25.4,46.99 26.56,45.83 v29.32,45.83
  Bottom 0.152: KEY_80.8 1.91,41.27 1.91,46.35 3.17,47.62 12.06,47.62 U2.A1 18.63,46.99 19.83,48.18 20.81,48.18 22.01,46.99 v25.4,46.99 | v29.32,45.83 30.48,46.99 U3.A1
A7
  Top 0.152: J1.2 11.11,58.42 | 11.11,58.42 C8.1 | R13.1 16.51,47.62 13.02,51.12 11.11,51.12 11.11,58.42
  Bottom 0.152: U2.A7 15.24,29.21 R13.1
BUTTONS  (via drill 0.35)
  Top 0.152: KEYBRD.7 5.08,13.65 7.94,13.65 7.94,41.91 KEY_80.9 | R7.2 U2.A2 | v65.41,47.94 66.99,49.53 KEYBRD1.7
  Bottom 0.152: v65.41,47.94 64.45,46.99 52.7,46.99 51.12,45.4 34.29,45.4 33.34,44.45 29.84,44.45 28.89,45.4 16.19,45.4 R7.2 | KEY_80.9 6.67,44.45 U2.A2
CAN_H
  Bottom 0.152: LED_BUS2C.1 80.33,52.07 80.33,47.94 77.79,47.94 SV1.3 65.09,46.67 62.87,44.45 59.37,44.45 59.37,40.96 CAN2.9
CAN_L
  Bottom 0.152: SV1.4 77.79,46.67 77.79,43.81 75.88,41.91 CAN2.8
CLOCK_K
  Top 0.152: KEYBRD.5 1.59,19.68 1.59,51.44 10.36,51.44 10.99,50.81 11.42,50.81 U2.A0
D2  (via drill 0.35)
  Top 0.152: U2.D2 26.35,33.34 26.35,42.45 25.69,43.11 25.69,43.43 25.06,44.06 25.06,45.24 24.77,45.53 24.77,48.26 26.67,50.16 26.67,51.44 26.35,51.75 26.35,57.47 26.67,57.78 26.67,62.23 35.56,62.23 40.64,57.15 48.26,57.15 49.92,55.49 51.82,55.49 52.7,54.61 v55.24,54.61
  Bottom 0.152: v55.24,54.61 70.48,54.61 73.03,52.07 LED_BUS2B.1 | KEY_80.1 6.67,33.02 17.46,33.02 17.78,32.7 23.18,32.7 23.5,33.02 25.4,33.02 26.67,31.75 U2.D2
D3
  Bottom 0.152: U2.D3 27.62,34.61 24.65,34.61 23.7,35.56 20.32,35.56 R4.2
D4
  Bottom 0.152: U2.D4 27.3,36.2 25.08,36.2 24.77,35.88 24.77,34.92 26.67,34.92 26.99,35.24 28.89,35.24 29.53,34.61 29.53,33.98 28.89,33.34 26.99,33.34 26.04,34.29 R5.2
D5  (via drill 0.35)
  Top 0.152: v30.48,38.42 31.75,37.15 R6.2
  Bottom 0.152: U2.D5 28.89,38.42 v30.48,38.42
D6  (via drill 0.35)
  Top 0.152: U2.D6 29.84,40.01 29.84,23.5 36.2,17.14 v42.23,17.14 | R1.2 50.8,12.7 50.8,14.29 52.86,16.34 52.86,21.1 53.51,21.75 54.44,21.75 55.56,20.64 U1.2
  Bottom 0.152: v42.23,17.14 42.43,17.14 44.72,14.86 46.1,14.86 R1.2
D7  (via drill 0.35)
  Top 0.152: S4.2 12.7,9.21 12.7,11.11 S1.4 | v25.72,42.23 26.04,41.91 26.04,26.67 26.4,26.3 26.4,17.41 28.57,15.24 28.57,12.7 28.26,12.38 19.68,12.38 19.68,11.43 S1.3
  Bottom 0.152: KEY_80.2 3.49,24.13 2.54,24.13 2.22,23.81 2.22,16.51 7.62,16.51 12.7,11.43 S1.4 13.02,11.43 19.37,11.43 S1.3 | v25.72,42.23 U2.D7
D8  (via drill 0.35)
  Top 0.152: S5.2 25.4,9.21 25.4,11.11 S2.4 | v22.54,46.04 24.13,44.45 24.13,32.8 23.57,32.24 23.57,23.64 24.27,22.94 24.37,22.94 v25.4,21.91
  Bottom 0.152: S2.3 32.07,11.43 25.72,11.43 S2.4 25.4,11.43 v25.4,21.91 | U2.D8 26.67,45.72 22.54,45.72 | 22.54,45.72 6.99,45.72 6.35,45.09 3.17,45.09 2.22,44.13 2.22,42.55 3.81,42.55 4.76,41.59 4.76,40.01 3.17,40.01 2.22,39.05 2.22,37.47 4.76,37.47 KEY_80.3 | 22.54,45.72 v22.54,46.04
D9
  Top 0.152: S6.2 38.1,9.21 38.1,11.11 S3.4
  Bottom 0.152: S3.3 44.77,11.43 38.42,11.43 S3.4 | U2.D9 27.62,49.21 22.11,49.21 21.79,49.53 20.01,49.53 18.9,50.64 18.9,51.26 16.9,53.26 14.75,53.26 14.43,52.95 11.04,52.95 9.27,51.17 5.65,51.17 4.64,50.16 3.17,50.16 1.59,48.58 1.59,36.2 1.91,36.2 | KEY_80.4 1.91,36.2 | S6.2 34.29,5.4 11.75,5.4 1.91,15.24 1.91,36.2
D10  (via drill 0.35)
  Top 0.152: U2.D10 30.48,49.53 v30.48,43.81
  Bottom 0.152: U2.D10 24.13,52.07 JP4.3 | KEY_80.5 6.67,38.1 29.84,38.1 31.11,36.83 33.66,36.83 35.24,38.42 36.51,38.42 37.15,39.05 37.15,43.18 CAN2.3 31.11,43.18 v30.48,43.81
D11
  Top 0.152: U2.D11 31.43,51.12 31.43,39.69 CAN2.5
  Bottom 0.152: U2.D11 28.89,55.56 37.15,55.56 38.1,56.52 48.9,56.52 U3.D11 | KEY_80.6 4.45,39.69 5.4,39.69 5.71,40.01 11.43,40.01 12.06,40.64 30.48,40.64 CAN2.5
D12
  Top 0.152: U2.D12 31.75,53.34 31.75,41.91 CAN2.4
  Bottom 0.152: U2.D12 32.07,57.15 33.34,58.42 37.47,58.42 38.43,57.45 49.02,57.45 49.33,57.15 U3.D12 | KEY_80.7 6.35,40.96 32.7,40.96 CAN2.4
DT0
  Top 0.152: O1.2 89.7,21.52 89.7,18.64 87.15,16.08 87.15,12.6 87.21,12.54 | INP.2 93.39,11.42 92.86,11.96 87.79,11.96 87.21,12.54 | U1.5 60.33,14.29 64.77,14.29 64.77,13.34 X1.2 | 79.86,67.97 78.03,67.97 LED7.4_DIN | 79.86,67.97 80.01,68.12 CON12.2 79.86,67.97 | 79.86,67.97 79.86,67.51 81.62,65.75 81.62,41.65 76.17,36.2 76.17,24.5 76.78,23.89 76.78,21.83 76.17,21.22 76.17,9.73 | 76.17,9.73 77.11,10.67 85.34,10.67 87.21,12.54 | 76.17,9.73 69.95,3.5 66.75,3.5 SV3.2
  Bottom 0.152: COPY_LED.3 88.31,32.12 O1.2 | R1.1 51.12,2.22 65.41,2.22 SV3.2 65.41,4.76 65.41,9.21 66.99,9.21 67.31,9.53 67.31,13.02 65.09,13.02 X1.2 | CJ2.1 77.27,70.87 80.01,68.12 CON12.2
DT1  (via drill 0.35)
  Top 0.152: LED5.4_DIN 63.25,67.97 65.84,67.97 66.14,68.28 CON8.2 66.29,68.28 69.8,68.28 CON11.1 69.85,67.94 72.52,67.94 72.85,68.28 73.09,68.52 v75.31,70.74 | v75.31,70.74 75.44,70.87 76.5,70.87 NJ2.2 | v75.31,70.73 v75.31,70.74
  Bottom 0.152: CJ2.2 75.58,71 v75.31,70.73
DT2
  Top 0.152: LED4.4_DIN 49.84,67.97 52.27,67.97 52.58,68.28 CON6.2 52.73,68.28 56.08,68.28 CON7.1 56.24,68.28 58.37,66.14 59.59,66.14 LED5.2_DOUT
DT3  (via drill 0.35)
  Top 0.152: LED4.2_DOUT 46.18,66.14 44.65,66.14 42.52,68.28 CON5.1 | CON5.1 | CON5.1 CON10.2 37.61,68.31 LED6.4-DIN 36.91,68.03 v36.83,67.94
  Bottom 0.152: CJ1.1 34.59,70.87 34.59,70.56 35.36,69.8 36.2,69.8 36.83,69.16 v36.83,67.94
DT4  (via drill 0.35)
  Top 0.152: LED3.4-DIN 23.32,68.89 24.69,68.89 25.15,68.43 CON4.2 25.3,68.28 28.65,68.28 CON9.1 28.8,68.28 29.41,67.67 33.83,67.67 36.58,70.41 | 36.58,70.41 35.97,71.02 NJ1.2 | 36.58,70.41 v36.88,70.1
  Bottom 0.152: v36.88,70.1 36.12,70.87 35.51,70.87 CJ1.2
DT5  (via drill 0.35)
  Top 0.152: LED2.4-DIN 9.45,68.89 10.97,68.89 11.43,68.43 CON1.2 11.43,68.28 14.94,68.28 CON3.1 | v16.76,66.6 17.53,65.84 18.29,65.84 LED3.2-DOUT
  Bottom 0.152: v16.76,66.6 15.09,68.28 CON3.1
GND  (via drill 0.35)
  Top 0.152: 64.14,10.16 64.14,10.48 X1.3 | 38.42,6.67 S3.2 | CON2.2 2.81,67.31 7.83,67.31 LED2.3-GND 11.37,65.71 CON1.3 CON3.2 16.57,67.31 21.6,67.31 LED3.3-GND 25.13,65.71 CON4.3 CON9.2 30.29,67.31 31.11,67.31 | 31.11,67.31 35.68,67.31 37,65.99 LED6.3-GND 36.98,65.77 CON10.3 CON5.2 45.31,65.77 45.65,65.43 49.09,65.43 LED4.3_GND 50.06,65.77 CON6.3 CON7.2 58.8,65.77 59.14,65.43 62.58,65.43 LED5.3_GND 65.93,66.09 CON8.3 69.8,65.77 CON11.2 | CON11.2 73.6,65.72 73.86,65.46 77.3,65.46 LED7.3_GND 79.61,66.12 CON12.3 | v31.11,67.06 31.11,67.31 | 69.85,65.41 CON11.2 | INP.3 INP.5 | O1.3 O1.5 92.08,21.68 92.08,37.47 O2.5 | O4.3 O4.5 92.08,56.52 92.08,49.62 O3.5 | O2.5 O2.3 | O3.5 O3.3 | O3.5 92.08,46.99 92.08,40.1 O2.5 | v74.93,35.31 74.59,34.97 74.59,33.27 73.7,32.38 X5.6
  Top 0.305: C8.2 15.24,65.56 CON3.2 | 69.85,65.41 69.85,59.79 70.73,58.91 70.73,57.07 KEYBRD1.4
  Top 0.61: X5.4 X5.6 X5.8 69.49,36.55 68.57,36.55 67.63,37.5 67.63,42.23 C7.2 | S4.1 12.38,5.08 12.7,5.4 | 12.7,5.4 12.94,5.64 S1.2 17.46,11.15 S4.- | 12.7,5.4 16.17,5.4 19.54,2.03 20.46,2.03 23.83,5.4 25.4,5.4 | OK1.5 38.1,41.91 R24.1 IC2.4 38.1,29.52 36.36,27.78 34.45,27.78 33.8,27.13 33.8,26.21 35.56,24.45 U3.GND | C8.2 J1.1 | CAN2.2 37.53,45.72
  Top 0.813: X4.1 X4.M | U1.6 54.61,17.46 U4.1 54.61,10.16 | 54.61,10.16 50.41,10.16 50.16,9.91 48.9,9.91 48.65,10.16 47.62,10.16 47.62,13.97 | C6.2 47.62,13.97 | 47.62,13.97 S6.- 42.86,11.8 42.76,11.7 42.76,11.01 38.42,6.67 | U4.6 54.61,10.16 | SV3.5 SV3.3 64.14,10.16 | S3.2 38.34,5.64 38.1,5.4 | 38.1,5.4 38.1,4.13 S6.1 | 38.1,5.4 36.67,5.4 33.21,1.93 32.2,1.93 28.73,5.4 25.4,5.4 | S5.1 25.08,5.08 25.4,5.4 | 25.4,5.4 25.4,6.39 S2.2 30.06,11.05 30.06,11.7 30.16,11.8 S5.-
  Top 1.016: LED1.K 34.25,58.46 36.76,58.46 37.53,57.69 37.53,45.72 37.53,45.02 OK1.5 | INP.3 O1.3
  Top 1.27: C8.2 16.92,59.28 16.92,53.75 R7.1 | KEYBRD1.4 69.53,55.71 71.21,54.03 71.21,45.81 C7.2 | C5.2 18.26,21.44 18.26,20.86 17.46,20.06 S4.- | v57.15,22.23 v55.24,24.13
  Bottom 0.152: 76.83,52.07 CAN_GND.2 | CON4.3 25.15,65.84 21.49,65.84 C13.2 21.34,65.99 18.9,68.43 18.9,70.71 C12.2 | CON1.3 11.43,65.84 7.62,65.84 C11.2 7.62,66.04 7.59,66.02 5.18,68.43 5.18,70.71 C10.2 | C19.2 35.2,65.84 38.86,65.84 CON10.3 | CON6.3 52.58,65.84 48.92,65.84 C15.2 48.77,65.99 46.33,68.43 46.33,70.71 C14.2 | CON8.3 66.14,65.84 62.18,65.84 C17.2 59.9,68.18 C16.2 | C18.2 31.29,67.23 v31.11,67.06 | C21.2 79.82,65.91 CON12.3 | C20.2 72.71,69.85 71.75,69.85 71.02,69.11 71.02,67.78 69.85,66.61 CON11.2 | v74.93,35.31 74.93,34.77 75.35,34.35 75.35,31.78 SJ_SX4.2
  Bottom 0.305: J1.1 10.16,64.57 11.43,65.84 | LED1.K 28.75,63.96 CON9.2
  Bottom 0.457: SX_GND.2 v55.24,24.13
  Bottom 0.61: X5.8 68.58,34.92 63.02,29.36 63.02,29.26 62.18,28.42 62.08,28.42 57.78,24.13 v55.24,24.13 54.61,24.13 53.34,25.4 53.34,26.67 U3.GND1 48.89,29.21 48.82,29.29 41.83,29.29 40.32,30.8 | X5.4 69.85,29.84 X3.2 | KEYBRD1.4 70.8,55.88 73.34,53.34 77.47,53.34 78.11,52.7 78.11,52.07 | 78.11,52.07 76.83,52.07 | 78.11,52.07 LED_BUS2C.2 | C5.2 17.78,23.5 17.78,24.13 | 17.78,24.13 U2.GND | C9.2 19.05,31.75 | 19.05,31.75 R26.1 25.28,31.75 25.81,31.22 25.93,31.22 U2.GND1 29.37,30.64 36.67,30.64 36.83,30.8 40.32,30.8 | 19.05,31.75 19.05,28.68 17.63,27.26 17.63,26.08 17.78,25.93 17.78,24.13 | IC2.4 40.32,30.8 | KEYBRD.4 8.03,20.32 8.23,20.52 10.91,20.52 S4.- | C7.2 76.2,43.81 SV1.5 | LED1.K 22.3,60.96 22.17,61.09 15.37,61.09 C8.2 | R7.1 13.81,50.64 5.88,50.64 4.13,48.9 KEY_80.14 | v57.15,22.23 57.15,18.1
  Bottom 0.762: X4.M 87.09,14.61 INP.5
  Bottom 0.813: X4.M 67.63,14.61 U1.1 57.15,18.1 U1.6 | U4.6 54.77,3.97 59.53,3.97 SV3.5
  pour Bottom: 0,63.5 81.28,63.5 82.55,62.23 82.55,2.54 80.01,0 0,0
  pour Bottom: 85.09,69.9 86.36,71.17 97.79,71.17 97.79,0.05 86.36,0.05 85.09,1.32
LEDS_K_SDA
  Top 0.152: KEYBRD.1 4.76,21.59 4.76,14.92 5.71,13.97 7.62,13.97 7.62,29.84 4.76,32.7 4.76,45.09 KEY_80.11
  Bottom 0.152: R12.2 19.37,46.04 6.35,46.04 KEY_80.11
N$1
  Bottom 0.152: U2.TX0 27.94,18.73 30.32,16.35 30.53,16.35 32.02,14.86 38.48,14.86 39.43,13.91 39.43,12.94 39.99,12.38 41.27,12.38 41.27,15.24 40.96,15.56 40.01,15.56 40.01,17.78 SJ1.2
N$2
  Bottom 0.305: X5.3 75.56,28.57 76.2,29.21 SJ_SX4.1
N$3
  Bottom 0.152: R26.2 U2.RX1 30.48,21.59 32.58,21.59 34.23,19.95 40.38,19.95 41.49,21.06 44.04,21.06 44.77,20.32 49.53,20.32 U3.TX0
N$4
  Top 0.152: S4.+ 15.24,14.29 15.24,22.86 R4.1
N$5  (via drill 0.35)
  Top 0.152: v25.4,35.56 24.45,36.51 24.45,44.45 24.43,44.46 24.43,45 21.59,47.85 21.59,57.15 JP3.2
  Bottom 0.152: U2.D13 12.7,59.69 JP3.2 | v25.4,35.56 CAN2.6
N$6
  Top 0.152: S5.+ 22.23,19.37 R5.1
N$7
  Bottom 0.152: S6.+ 40.32,14.81 39.7,15.43 39.7,16.18 38.41,17.48 34.58,17.48 33.01,19.05 R6.1
N$8  (via drill 0.35)
  Top 0.152: v41.91,46.04 OK1.6 41.91,26.67 IC2.7 | U3.D2 48.26,29.21 R21.1
  Bottom 0.152: v41.91,46.04 42.86,46.04 43.18,46.35 NO_OPTO.1 | R21.1 43.18,27.94 | 43.18,27.94 SJ_SX2.2 | 43.18,27.94 IC2.7
N$10
  Bottom 0.152: SV1.1 73.98,49.21 73.66,48.9 LED_BUS2A.2
N$11
  Bottom 0.152: U4.2 53.34,12.7 60.01,12.7 | 60.01,12.7 62.55,12.7 62.87,13.02 X1.4 | SV3.4 62.87,4.76 62.87,9.84 60.01,12.7
N$12
  Top 0.61: X2.2 43.5,59.37 B1.AC2 R8.2
N$13
  Bottom 0.61: B1.AC1 47.95,61.92 57.77,61.92 58.1,61.59 X2.M X2.1
N$14  (via drill 0.35)
  Top 0.152: B1.+ 45.72,53.34 45.72,49.85 50.16,45.4 v52.7,45.4
  Top 0.61: C2.1 57.78,45.72 | IC1.IN 57.78,45.72 | 57.78,45.72 C4.1 59.05,38.73 D1.C
  Bottom 0.152: v52.7,45.4 53.02,45.72 IC1.IN
  Bottom 0.61: D1.C 62.12,36.2 63.55,37.62 66.81,37.62 67.91,36.51 71.17,36.51 72.87,34.81 74.14,34.81 74.82,34.13 74.82,33.18 74.14,32.5 73.41,32.5 72.28,31.36 72.28,29.37 71.6,28.69 70.46,28.69 69.81,28.04 68.61,28.04 67.63,29.02 SJ_SX3.2
N$15
  Top 0.152: U2.RST 17.78,26.67 JP4.1
N$16
  Top 0.152: U3.D4 49.53,35.56 49.53,34.92 48.26,33.66 R22.1
  Bottom 0.152: 46.04,32.7 46.35,33.02 R22.1 | 46.04,32.7 43.81,30.48 SJ_SX1.2 | 46.04,32.7 IC2.1
N$17
  Top 0.152: B1.- 58.42,53.34 58.42,48.26
  Top 0.61: C3.2 55.24,30.48 52.63,33.1 52.63,34.21 55.24,36.83 C4.2 55.24,44.5 54.53,45.22 54.53,46.28 IC1.GND 58.42,48.26 59.06,48.26 59.13,48.18 60.25,48.18 60.32,48.26 62.23,48.26 | C2.2 62.23,48.26 | C1.2 62.23,48.26
  Bottom 0.152: C3.2 SX_GND.1 | OK1.3 44.45,53.34 B1.-
N$18  (via drill 0.35)
  Top 0.152: v52.07,19.68 52.07,20.96 52.34,21.22 52.34,21.96 50.8,23.49 U3.RX1
  Bottom 0.152: SJ1.1 40.96,17.78 42.07,18.89 51.28,18.89 v52.07,19.68
N$19
  Bottom 0.152: R3.1 LED1.A
N$20
  Bottom 0.152: U3.D13 34.61,56.2 25.08,56.2 JP3.1
N$21  (via drill 0.35)
  Top 0.152: v44.45,47.31 OK1.2 43.18,52.07 40.64,52.07 R8.1
  Bottom 0.152: v44.45,47.31 43.31,47.31 NO_OPTO.2
N$23
  Top 0.152: KEYBRD1.8 66.67,47.94 C7.1 66.04,43.18 R14.1
  Bottom 0.152: SJ4.2 64.14,40.96 61.59,40.96 61.28,40.64 60.64,40.64 59.84,41.44 59.84,42.37 60.65,43.18 R14.1
N$24  (via drill 0.35)
  Top 0.152: KEYBRD.2 1.91,26.99 1.91,49.85 v2.86,50.8
  Bottom 0.152: KEYBRD1.1 63.82,55.24 55.24,55.24 54.61,55.88 50.17,55.88 48.9,57.15 38.1,57.15 36.83,55.88 27.31,55.88 25.4,53.97 25.4,53.96 14.58,53.96 14.18,53.56 10.79,53.56 9.3,52.07 5.69,52.07 5.02,51.41 3.56,51.41 2.95,50.8 v2.86,50.8
N$25  (via drill 0.35)
  Top 0.152: KEYBRD.8 7.3,16.51 7.3,28.26 2.22,33.34 2.22,49.21 v3.81,50.8
  Bottom 0.152: KEYBRD1.5 66.67,53.66 49.85,53.66 49.21,54.3 49.21,55.56 48.9,55.88 38.1,55.88 37.15,54.93 37.15,54.29 36.51,53.66 14.71,53.66 14.31,53.26 10.92,53.26 9.21,51.55 5.6,51.55 4.85,50.8 v3.81,50.8
N$26
  Bottom 0.61: X5.2 71.12,26.04 | X5.1 71.12,26.04 | SJ_SX3.1 68.77,26.04 69.22,26.04 | X3.3 69.22,26.04 | 71.12,26.04 69.22,26.04
N$27
  Bottom 0.152: U2.A6 13.97,35.56 15.56,35.56 18.1,33.02 23.06,33.02 23.38,33.34 26.35,33.34 26.67,33.02 29.84,33.02 31.11,34.29 33.34,34.29 34.29,35.24 35.88,35.24 38.42,37.78 51.75,37.78 52.07,37.47 61.59,37.47 64.14,40.01 SJ4.1
N$28
  Bottom 0.152: U3.D10 47.94,49.21 37.78,49.21 36.51,50.48 26.99,50.48 26.04,49.53 22.23,49.53 20.95,50.8 JP4.2
N$29
  Bottom 0.152: LED_BUS2B.2 CAN_GND.1 75.88,52.07 75.88,50.48 77.79,50.48 SV1.2
N$30  (via drill 0.35)
  Top 0.152: v3.05,66.6 3.81,65.84 4.42,65.84 LED2.2-DOUT
  Bottom 0.152: v3.05,66.6 1.37,68.28 CON2.1
N$38
  Top 0.152: R23.1 IC2.2 | IC2.6 39.37,26.67 39.37,34.29 R24.2
  Bottom 0.152: R24.2 R23.1
N$39
  Bottom 0.152: SJ_SX1.1 42.55,30.48 40.64,32.38 IC2.3 41.91,34.29 48.58,34.29 49.53,33.34 53.66,33.34 R25.1
N$42
  Top 0.152: IC2.5 R28.1
  Bottom 0.152: IC2.5 38.1,26.04 40.01,27.94 SJ_SX2.1
N$49  (via drill 0.35)
  Top 0.152: v33.53,68.28 34.9,69.65 34.9,70.87 NJ1.1 | v33.22,66.6 32.61,65.99 32.46,65.99 LED6.2-DOUT
  Bottom 0.152: v33.53,68.28 33.53,66.9 v33.22,66.6
N$52
  Top 0.152: O4.2 88.31,59.41 89.43,58.3 89.43,52.27 O3.4
  Bottom 0.152: O4.2 90.22,62.28 97.32,62.28 97.32,8.94 92.76,8.94 INP.4
N$55
  Bottom 0.152: O2.2 85.24,41.32 85.24,32.65 COPY_LED.2
N$56
  Top 0.152: NJ2.1 77.05,70.57 77.05,70.19 76.83,69.97 76.83,69.85 76.2,69.22 74.3,69.22 73.03,67.94 73.03,66.67 73.58,66.12 LED7.2_DOUT
N$58
  Top 0.152: O3.2 89.73,49.42 89.73,47.84 90.85,46.73 O2.4
N$60
  Bottom 0.152: COPY_LED.1 86.72,21.64 89.58,21.64 O1.4
PE
  Top 0.305: X3.PE X3.PE@
POWER2
  Top 0.61: INP.6 90.22,8.94 96.14,8.94 96.14,22.91 | O4.6 96.14,60.37 96.14,50.85 | 96.14,22.91 96.14,41.32 | 96.14,41.32 96.14,50.85 | O3.6 96.14,50.85 | O2.6 96.14,41.32 | O1.6 96.14,22.91
RESET_K  (via drill 0.35)
  Top 0.152: v8.57,19.68 11.11,22.23 11.11,40.32 U2.A3 | v25.08,43.18 24.75,43.51 24.75,45.12 24.13,45.74 24.13,49.53 R3.2
  Bottom 0.152: KEY_80.10 4.76,42.55 12.06,42.55 U2.A3 13.97,43.18 v25.08,43.18 | KEYBRD.6 7.94,19.68 v8.57,19.68 | KEYBRD1.6 68.26,52.07 66.04,52.07 64.77,53.34 48.58,53.34 47.31,52.07 44.13,52.07 43.18,51.12 43.18,49.53 38.1,49.53 36.83,50.8 R3.2
SCL
  Top 0.152: 14.29,36.83 U2.A5 | 14.29,36.83 14.29,42.86 11.75,42.86 11.11,43.5 11.11,49.85 10.16,50.8 6.35,50.8 4.61,49.06 4.61,47.47 KEY_80.12 | 14.29,36.83 R27.1 C9.1
SDA
  Bottom 0.152: R12.1 U2.A4
SX_T0
  Top 0.305: X5.7 72.12,35.19 72.12,35.34 71.54,35.93 71.39,35.93 X3.1
  Bottom 0.305: X5.7 69.22,33.66 58.47,22.91 56.87,22.91 56.82,22.86 R28.2
SX_T1
  Top 0.305: X5.5 72.12,29.58 72.12,29.43 71,28.31 69.87,28.31 69.75,28.19 68.68,28.19 68.61,28.26 67.31,28.26 66.67,28.89 X3.4
  Bottom 0.152: X3.4 65.48,34.37 57.23,34.37 R25.2

### Text on the board
Top: Top | +5V
Bottom: Bot | GND | MobaLedLib
tPlace: + | Normal
bPlace: https://www.stummiforum.de/viewtopic.php?f=7&t=165060 | https://wiki.mobaledlib.de/doku.php | by Hardi | by Hardi | ) | (100- | Main Module
tNames: Ver.: | 3535 | 3535 | 5050 | 5050 | 5050 | 3535 | DCC | LEDs Main / Module | DCC Nano | LEDs 2 | CAN | LEDs Main / Module | LED Nano | Selectrix | LED0 | Ver.: | GND +5V | by Hardi | MobaLedLib | + | <= | => | L+R / =All | + | Long / =ESC | + | by Hardi | LED / Test | Sim / Inp. | Inp. / Test | LED N | by Hardi
bNames: <- für Alf | -Arduino_fuer_LEDs | 100-